# EAGLE design NixieConnector (EAGLE 7.2.0)
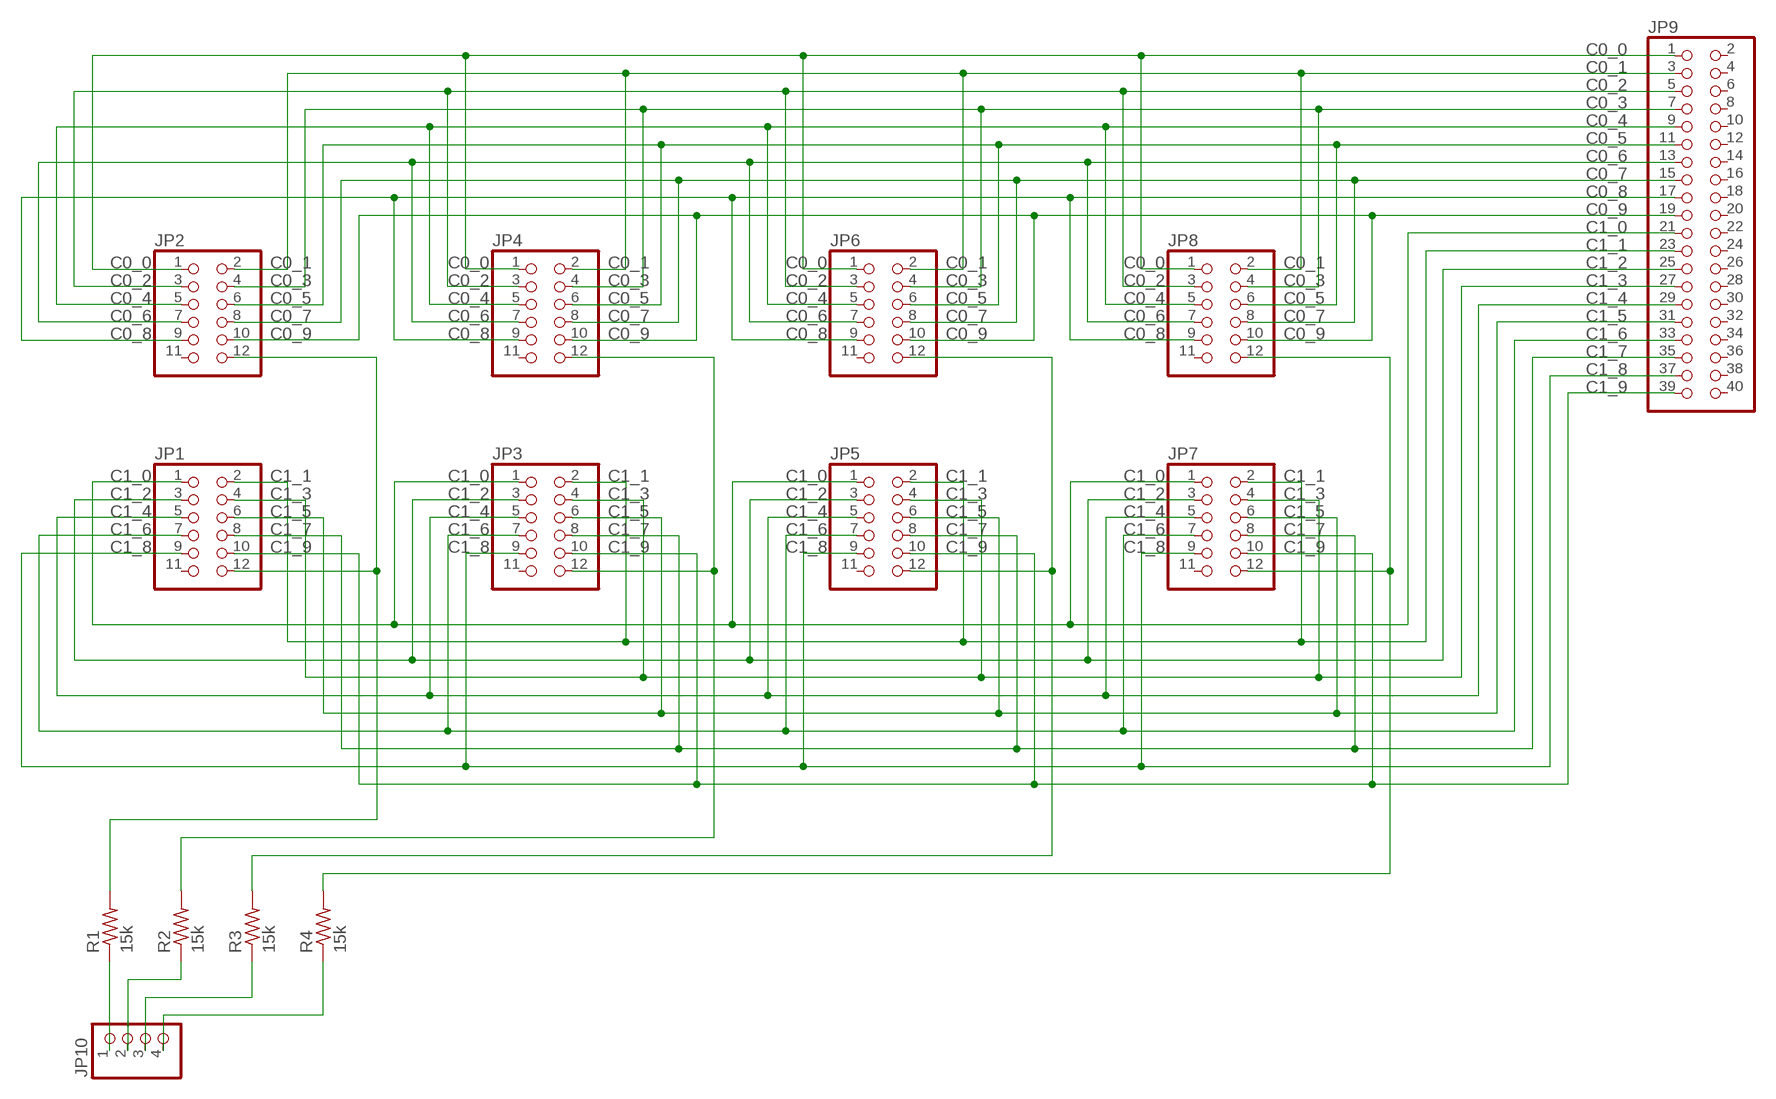
[diagram p0: schematic, sheet 1]

## Parts
JP1  PINHD-2X6  [2X06]
JP2  PINHD-2X6  [2X06]
JP3  PINHD-2X6  [2X06]
JP4  PINHD-2X6  [2X06]
JP5  PINHD-2X6  [2X06]
JP6  PINHD-2X6  [2X06]
JP7  PINHD-2X6  [2X06]
JP8  PINHD-2X6  [2X06]
JP9  PINHD-2X20  [2X20]
JP10  PINHD-1X4  [1X04]
R1  15k  R-US_0204/5  [0204/5]
R2  15k  R-US_0204/5  [0204/5]
R3  15k  R-US_0204/5  [0204/5]
R4  15k  R-US_0204/5  [0204/5]

## Nets
A1_IN: JP10.1 R1.1
A1_R: JP1.12 JP2.12 R1.2
A2_IN: JP10.2 R2.1
A2_R: JP3.12 JP4.12 R2.2
A3_IN: JP10.3 R3.1
A3_R: JP5.12 JP6.12 R3.2
A4_IN: JP10.4 R4.1
A4_R: JP7.12 JP8.12 R4.2
C0_0: JP2.1 JP4.1 JP6.1 JP8.1 JP9.1
C0_1: JP2.2 JP4.2 JP6.2 JP8.2 JP9.3
C0_2: JP2.3 JP4.3 JP6.3 JP8.3 JP9.5
C0_3: JP2.4 JP4.4 JP6.4 JP8.4 JP9.7
C0_4: JP2.5 JP4.5 JP6.5 JP8.5 JP9.9
C0_5: JP2.6 JP4.6 JP6.6 JP8.6 JP9.11
C0_6: JP2.7 JP4.7 JP6.7 JP8.7 JP9.13
C0_7: JP2.8 JP4.8 JP6.8 JP8.8 JP9.15
C0_8: JP2.9 JP4.9 JP6.9 JP8.9 JP9.17
C0_9: JP2.10 JP4.10 JP6.10 JP8.10 JP9.19
C1_0: JP1.1 JP3.1 JP5.1 JP7.1 JP9.21
C1_1: JP1.2 JP3.2 JP5.2 JP7.2 JP9.23
C1_2: JP1.3 JP3.3 JP5.3 JP7.3 JP9.25
C1_3: JP1.4 JP3.4 JP5.4 JP7.4 JP9.27
C1_4: JP1.5 JP3.5 JP5.5 JP7.5 JP9.29
C1_5: JP1.6 JP3.6 JP5.6 JP7.6 JP9.31
C1_6: JP1.7 JP3.7 JP5.7 JP7.7 JP9.33
C1_7: JP1.8 JP3.8 JP5.8 JP7.8 JP9.35
C1_8: JP1.9 JP3.9 JP5.9 JP7.9 JP9.37
C1_9: JP1.10 JP3.10 JP5.10 JP7.10 JP9.39
Unconnected: JP1.11 JP2.11 JP3.11 JP4.11 JP5.11 JP6.11 JP7.11 JP8.11 JP9.2 JP9.4 JP9.6 JP9.8 JP9.10 JP9.12 JP9.14 JP9.16 JP9.18 JP9.20 JP9.22 JP9.24 JP9.26 JP9.28 JP9.30 JP9.32 JP9.34 JP9.36 JP9.38 JP9.40

## Library data of the parts
JP1-JP8 = pinhead:PINHD-2X6: PIN HEADER
JP9 = pinhead:PINHD-2X20: PIN HEADER
JP10 = pinhead:PINHD-1X4: PIN HEADER
R1-R4 = resistor:R-US_: RESISTOR, American symbol

## Net classes
0 default: width 0.254 mm, clearance 0.254 mm

## Board
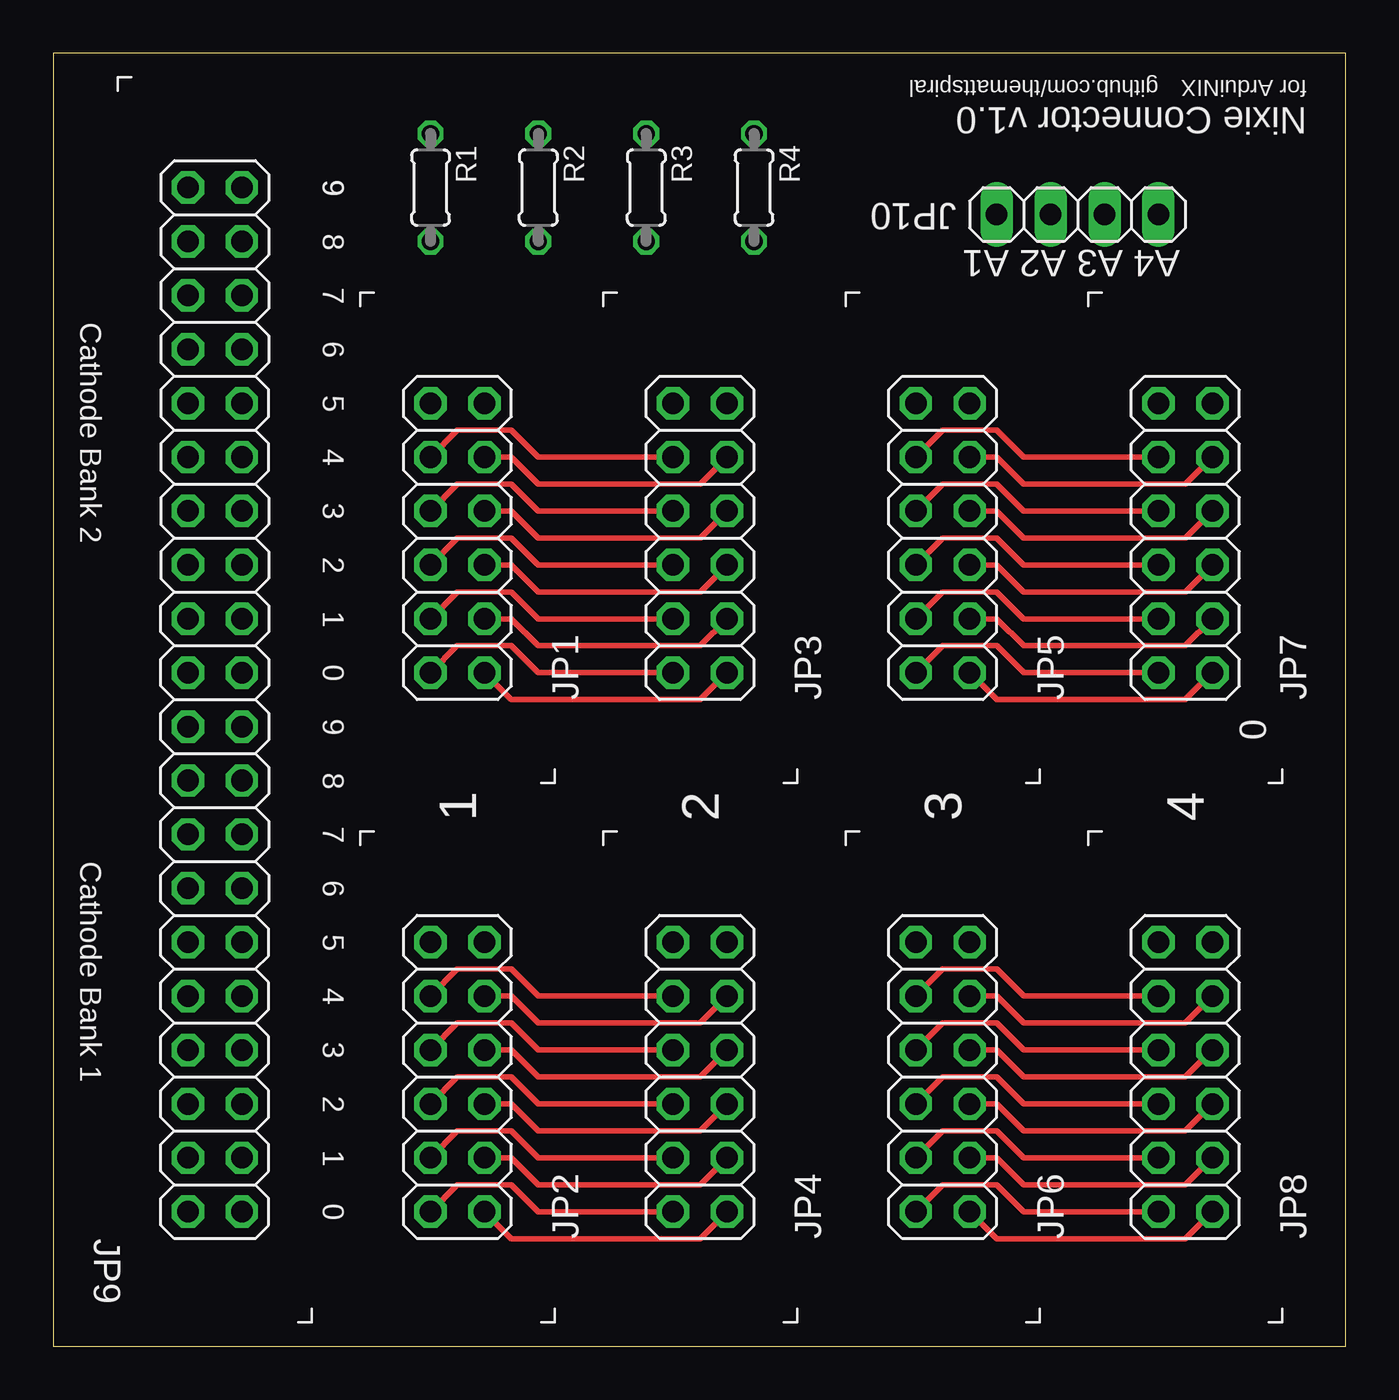
[diagram p1: board, top side]
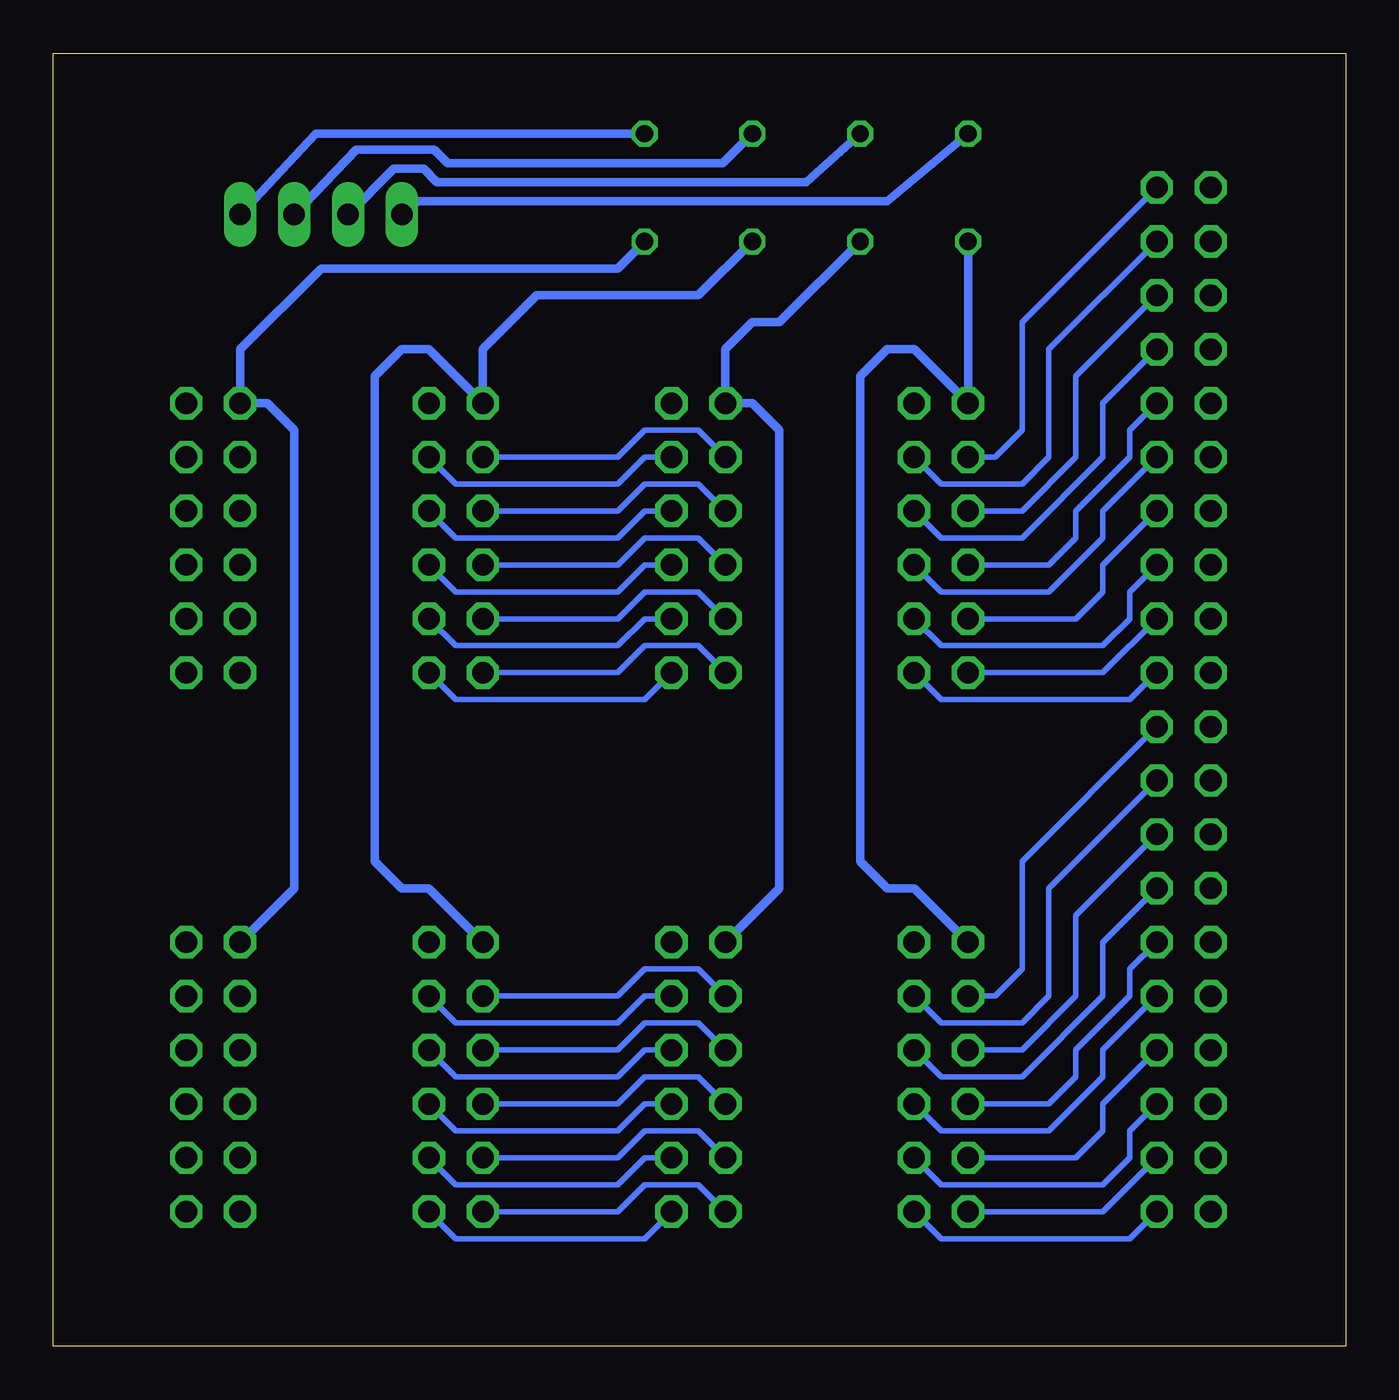
[diagram p2: board, bottom side, seen from below]

Size 60.88 x 60.95 mm. Coordinates in mm from the lower left corner, seen from the top.
Outline: 0,0 60.88,0 60.88,60.95 0,60.95 0,0
Copper layers (1*16): Top 0.0356mm / dielectric 1.5011mm / Bottom 0.0356mm
Design rules "LaenPCBOrder": minimum track width 6mil, minimum drill 13mil, track to track 6mil, track to pad 6mil, pad to pad 6mil, via to via 6mil, smd to smd 6mil, copper to edge 15mil, drill to drill 6mil, minimum pad ring 7mil, minimum via ring 7mil, stop-mask expansion 3mil, vias tented up to drill 0mil, thermal gap 10mil

### Footprints (pad centres in the part's own frame; a part is rotated, then mirrored left to right if it is on the bottom)
2X06 = drill 1.016 octagon: 1 -6.35,-1.27; 2 -6.35,1.27; 3 -3.81,-1.27; 4 -3.81,1.27; 5 -1.27,-1.27; 6 -1.27,1.27; 7 1.27,-1.27; 8 1.27,1.27; 9 3.81,-1.27; 10 3.81,1.27; 11 6.35,-1.27; 12 6.35,1.27
2X20 = drill 1.016 octagon: 1 -24.13,-1.27; 2 -24.13,1.27; 3 -21.59,-1.27; 4 -21.59,1.27; 5 -19.05,-1.27; 6 -19.05,1.27; 7 -16.51,-1.27; 8 -16.51,1.27; 9 -13.97,-1.27; 10 -13.97,1.27; 11 -11.43,-1.27; 12 -11.43,1.27; 13 -8.89,-1.27; 14 -8.89,1.27; 15 -6.35,-1.27; 16 -6.35,1.27; 17 -3.81,-1.27; 18 -3.81,1.27; 19 -1.27,-1.27; 20 -1.27,1.27; 21 1.27,-1.27; 22 1.27,1.27; 23 3.81,-1.27; 24 3.81,1.27; 25 6.35,-1.27; 26 6.35,1.27; 27 8.89,-1.27; 28 8.89,1.27; 29 11.43,-1.27; 30 11.43,1.27; 31 13.97,-1.27; 32 13.97,1.27; 33 16.51,-1.27; 34 16.51,1.27; 35 19.05,-1.27; 36 19.05,1.27; 37 21.59,-1.27; 38 21.59,1.27; 39 24.13,-1.27; 40 24.13,1.27
1X04 = drill 1.016 long: 1 -3.81,0; 2 -1.27,0; 3 1.27,0; 4 3.81,0
0204/5 = drill 0.813 octagon: 1 -2.54,0; 2 2.54,0

### Placement (x,y rotation side)
JP1  19.05,38.1 90 top
JP2  19.05,12.7 90 top
JP3  30.48,38.1 90 top
JP4  30.48,12.7 90 top
JP5  41.91,38.1 90 top
JP6  41.91,12.7 90 top
JP7  53.34,38.1 90 top
JP8  53.34,12.7 90 top
JP9  7.62,30.48 90 top
JP10  48.26,53.34 0 top
R1  17.78,54.61 270 top
R2  22.86,54.61 270 top
R3  27.94,54.61 270 top
R4  33.02,54.61 270 top

### Tracks (layer width: path | path; a pad name or v marks a point on that pad's centre or on a via)
A1_IN
  Bottom 0.406: JP10.1 43.69,53.98 21.59,53.98 R1.1
A1_R
  Bottom 0.406: R1.2 JP1.12 20.32,46.99 21.59,46.99 22.86,45.72 22.86,22.86 21.59,21.59 20.32,21.59 JP2.12
A2_IN
  Bottom 0.406: JP10.2 44.83,55.5 43.43,55.5 42.8,54.86 25.4,54.86 R2.1
A2_R
  Bottom 0.406: R2.2 26.67,48.26 27.94,48.26 29.21,46.99 JP3.12 27.94,44.45 26.67,43.18 26.67,21.59 JP4.12
A3_IN
  Bottom 0.406: JP10.3 46.61,56.39 42.93,56.39 42.29,55.75 29.34,55.75 R3.1
A3_R
  Bottom 0.406: R3.2 30.48,49.53 38.1,49.53 40.64,46.99 JP5.12 43.18,46.99 44.45,46.99 45.72,45.72 45.72,22.86 44.45,21.59 43.18,21.59 JP6.12
A4_IN
  Bottom 0.406: R4.1 48.51,57.15 JP10.4
A4_R
  Bottom 0.406: JP8.12 49.53,21.59 49.53,43.18 50.8,44.45 JP7.12 52.07,46.99 48.26,50.8 34.29,50.8 R4.2
C0_0
  Top 0.254: JP2.1 21.59,5.08 30.48,5.08 JP4.1 | JP6.1 44.45,5.08 53.34,5.08 JP8.1
  Bottom 0.254: JP9.1 10.16,5.08 19.05,5.08 JP2.1 | JP4.1 33.02,5.08 41.91,5.08 JP6.1
C0_1
  Top 0.254: JP2.2 19.05,7.62 21.59,7.62 22.86,6.35 JP4.2 | JP6.2 41.91,7.62 44.45,7.62 45.72,6.35 JP8.2
  Bottom 0.254: JP9.3 11.43,6.35 JP2.2 | JP4.2 30.48,7.62 33.02,7.62 34.29,6.35 JP6.2
C0_2
  Top 0.254: JP2.3 21.59,8.89 22.86,7.62 30.48,7.62 JP4.3 | JP6.3 44.45,8.89 45.72,7.62 53.34,7.62 JP8.3
  Bottom 0.254: JP9.5 10.16,10.16 10.16,8.89 11.43,7.62 19.05,7.62 JP2.3 | JP4.3 33.02,8.89 34.29,7.62 41.91,7.62 JP6.3
C0_3
  Top 0.254: JP2.4 19.05,10.16 21.59,10.16 22.86,8.89 JP4.4 | JP6.4 41.91,10.16 44.45,10.16 45.72,8.89 JP8.4
  Bottom 0.254: JP9.7 11.43,11.43 11.43,10.16 12.7,8.89 JP2.4 | JP4.4 30.48,10.16 33.02,10.16 34.29,8.89 JP6.4
C0_4
  Top 0.254: JP2.5 21.59,11.43 22.86,10.16 30.48,10.16 JP4.5 | JP6.5 44.45,11.43 45.72,10.16 53.34,10.16 JP8.5
  Bottom 0.254: JP9.9 11.43,13.97 11.43,12.7 13.97,10.16 19.05,10.16 JP2.5 | JP4.5 33.02,11.43 34.29,10.16 41.91,10.16 JP6.5
C0_5
  Top 0.254: JP2.6 19.05,12.7 21.59,12.7 22.86,11.43 JP4.6 | JP6.6 41.91,12.7 44.45,12.7 45.72,11.43 JP8.6
  Bottom 0.254: JP9.11 10.16,17.78 10.16,16.51 12.7,13.97 12.7,12.7 13.97,11.43 JP2.6 | JP4.6 30.48,12.7 33.02,12.7 34.29,11.43 JP6.6
C0_6
  Top 0.254: JP2.7 21.59,13.97 22.86,12.7 30.48,12.7 JP4.7 | JP6.7 44.45,13.97 45.72,12.7 53.34,12.7 JP8.7
  Bottom 0.254: JP9.13 11.43,19.05 11.43,16.51 15.24,12.7 19.05,12.7 JP2.7 | JP4.7 33.02,13.97 34.29,12.7 41.91,12.7 JP6.7
C0_7
  Top 0.254: JP2.8 19.05,15.24 21.59,15.24 22.86,13.97 JP4.8 | JP6.8 41.91,15.24 44.45,15.24 45.72,13.97 JP8.8
  Bottom 0.254: JP9.15 12.7,20.32 12.7,16.51 15.24,13.97 JP2.8 | JP4.8 30.48,15.24 33.02,15.24 34.29,13.97 JP6.8
C0_8
  Top 0.254: JP2.9 21.59,16.51 22.86,15.24 30.48,15.24 JP4.9 | JP6.9 44.45,16.51 45.72,15.24 53.34,15.24 JP8.9
  Bottom 0.254: JP9.17 13.97,21.59 13.97,16.51 15.24,15.24 19.05,15.24 JP2.9 | JP4.9 33.02,16.51 34.29,15.24 41.91,15.24 JP6.9
C0_9
  Top 0.254: JP2.10 19.05,17.78 21.59,17.78 22.86,16.51 JP4.10 | JP6.10 41.91,17.78 44.45,17.78 45.72,16.51 JP8.10
  Bottom 0.254: JP9.19 15.24,22.86 15.24,17.78 16.51,16.51 JP2.10 | JP4.10 30.48,17.78 33.02,17.78 34.29,16.51 JP6.10
C1_0
  Top 0.254: JP1.1 21.59,30.48 30.48,30.48 JP3.1 | JP5.1 44.45,30.48 53.34,30.48 JP7.1
  Bottom 0.254: JP9.21 10.16,30.48 19.05,30.48 JP1.1 | JP3.1 33.02,30.48 41.91,30.48 JP5.1
C1_1
  Top 0.254: JP1.2 19.05,33.02 21.59,33.02 22.86,31.75 JP3.2 | JP5.2 41.91,33.02 44.45,33.02 45.72,31.75 JP7.2
  Bottom 0.254: JP9.23 11.43,31.75 JP1.2 | JP3.2 30.48,33.02 33.02,33.02 34.29,31.75 JP5.2
C1_2
  Top 0.254: JP1.3 21.59,34.29 22.86,33.02 30.48,33.02 JP3.3 | JP5.3 44.45,34.29 45.72,33.02 53.34,33.02 JP7.3
  Bottom 0.254: JP9.25 10.16,35.56 10.16,34.29 11.43,33.02 19.05,33.02 JP1.3 | JP3.3 33.02,34.29 34.29,33.02 41.91,33.02 JP5.3
C1_3
  Top 0.254: JP1.4 19.05,35.56 21.59,35.56 22.86,34.29 JP3.4 | JP5.4 41.91,35.56 44.45,35.56 45.72,34.29 JP7.4
  Bottom 0.254: JP9.27 11.43,36.83 11.43,35.56 12.7,34.29 JP1.4 | JP3.4 30.48,35.56 33.02,35.56 34.29,34.29 JP5.4
C1_4
  Top 0.254: JP1.5 21.59,36.83 22.86,35.56 30.48,35.56 JP3.5 | JP5.5 44.45,36.83 45.72,35.56 53.34,35.56 JP7.5
  Bottom 0.254: JP9.29 11.43,39.37 11.43,38.1 13.97,35.56 19.05,35.56 JP1.5 | JP3.5 33.02,36.83 34.29,35.56 41.91,35.56 JP5.5
C1_5
  Top 0.254: JP1.6 19.05,38.1 21.59,38.1 22.86,36.83 JP3.6 | JP5.6 41.91,38.1 44.45,38.1 45.72,36.83 JP7.6
  Bottom 0.254: JP9.31 10.16,43.18 10.16,41.91 12.7,39.37 12.7,38.1 13.97,36.83 JP1.6 | JP3.6 30.48,38.1 33.02,38.1 34.29,36.83 JP5.6
C1_6
  Top 0.254: JP1.7 21.59,39.37 22.86,38.1 30.48,38.1 JP3.7 | JP5.7 44.45,39.37 45.72,38.1 53.34,38.1 JP7.7
  Bottom 0.254: JP9.33 11.43,44.45 11.43,41.91 15.24,38.1 19.05,38.1 JP1.7 | JP3.7 33.02,39.37 34.29,38.1 41.91,38.1 JP5.7
C1_7
  Top 0.254: JP1.8 19.05,40.64 21.59,40.64 22.86,39.37 JP3.8 | JP5.8 41.91,40.64 44.45,40.64 45.72,39.37 JP7.8
  Bottom 0.254: JP9.35 12.7,45.72 12.7,41.91 15.24,39.37 JP1.8 | JP3.8 30.48,40.64 33.02,40.64 34.29,39.37 JP5.8
C1_8
  Top 0.254: JP1.9 21.59,41.91 22.86,40.64 30.48,40.64 JP3.9 | JP5.9 44.45,41.91 45.72,40.64 53.34,40.64 JP7.9
  Bottom 0.254: JP9.37 13.97,46.99 13.97,41.91 15.24,40.64 19.05,40.64 JP1.9 | JP3.9 33.02,41.91 34.29,40.64 41.91,40.64 JP5.9
C1_9
  Top 0.254: JP1.10 19.05,43.18 21.59,43.18 22.86,41.91 JP3.10 | JP5.10 41.91,43.18 44.45,43.18 45.72,41.91 JP7.10
  Bottom 0.254: JP9.39 15.24,48.26 15.24,43.18 16.51,41.91 JP1.10 | JP3.10 30.48,43.18 33.02,43.18 34.29,41.91 JP5.10

### Text on the board
tPlace: github.com/themattspiral | for ArduiNIX | Nixie Connector v1.0 | 9 | 9 | 8 | A4 A3 A2 A1 | 7 | Cathode Bank 2 | 6 | 5 | 4 | 3 | 2 | 1 | 0 | 9 | 0 | 8 | 7 | 1 | 2 | 3 | 4 | Cathode Bank 1 | 6 | 5 | 4 | 3 | 2 | 1 | 0